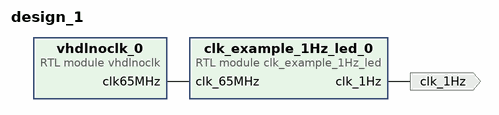
[diagram p0: block diagram of the top level]
# Vivado block design design_1, xc7z007sclg225-1, Vivado 2018.3
create_bd_design design_1

create_bd_port -dir O clk_1Hz

create_bd_cell -type module -reference vhdlnoclk vhdlnoclk_0
create_bd_cell -type module -reference clk_example_1Hz_led clk_example_1Hz_led_0

# ---- connections ----

connect_bd_net [get_bd_pins vhdlnoclk_0/clk65MHz] [get_bd_pins clk_example_1Hz_led_0/clk_65MHz]
connect_bd_net [get_bd_pins clk_example_1Hz_led_0/clk_1Hz] [get_bd_ports clk_1Hz]

validate_bd_design
save_bd_design
